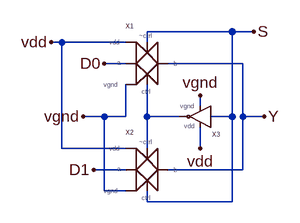
[diagram p0: schematic Mux_TG_2.asc]
Mux_TG_2.asc, the LTspice schematic file:
Version 4.1
SHEET 1 880 680
WIRE 352 64 224 64
WIRE 384 64 352 64
WIRE 96 80 80 80
WIRE 192 80 96 80
WIRE 224 80 224 64
WIRE 192 112 160 112
WIRE 368 112 256 112
WIRE 304 176 304 160
WIRE 160 192 128 192
WIRE 192 192 192 144
WIRE 192 192 160 192
WIRE 224 192 224 144
WIRE 272 192 224 192
WIRE 352 192 352 64
WIRE 352 192 320 192
WIRE 368 192 368 112
WIRE 400 192 368 192
WIRE 96 240 96 80
WIRE 192 240 96 240
WIRE 224 240 224 192
WIRE 304 240 304 208
WIRE 192 272 144 272
WIRE 368 272 368 192
WIRE 368 272 256 272
WIRE 160 304 160 192
WIRE 192 304 160 304
WIRE 224 320 224 304
WIRE 352 320 352 192
WIRE 352 320 224 320
FLAG 160 112 D0
FLAG 80 80 vdd
FLAG 144 272 D1
FLAG 384 64 S
FLAG 400 192 Y
FLAG 304 240 vdd
FLAG 128 192 vgnd
FLAG 304 160 vgnd
SYMBOL Transmission_Gate_2 224 96 R0
SYMATTR InstName X1
SYMBOL Transmission_Gate_2 224 256 R0
SYMATTR InstName X2
SYMBOL CMOS_Inverter 304 192 R180
SYMATTR InstName X3

The netlist it stands for:
* Mux_TG_2.asc
X§X1 vdd vgnd D0 Y N001 S Transmission_Gate_2  ; pins vdd vgnd a b ctrl ~ctrl
X§X2 vdd vgnd D1 Y S N001 Transmission_Gate_2  ; pins vdd vgnd a b ctrl ~ctrl
X§X3 S N001 vdd vgnd CMOS_Inverter  ; pins i o vdd vgnd
.backanno
.end